# Altium schematic sheet 02_Input.SchDoc
size A
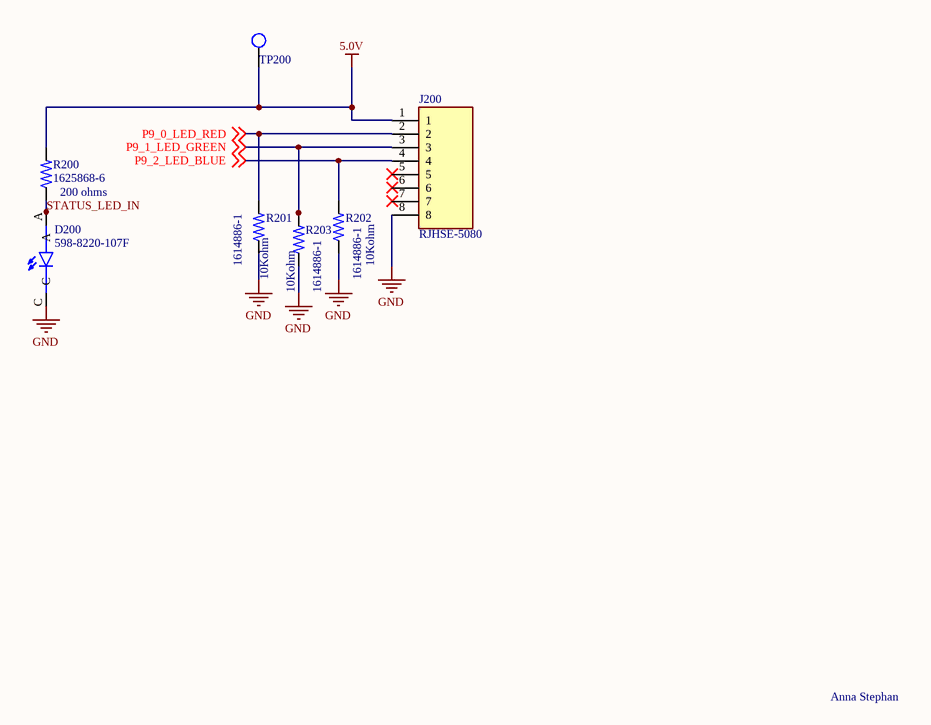
[diagram p0: 02_Input.SchDoc]

## Parts
D200  598-8220-107F  [LEDSC160X320X90-2N]
J200  RJHSE-5080  [CONN_RJSBE5080_16P13X12P57_AMP]
R200  1625868-6  [RESC2012X65N]
R201  1614886-1  [RESC2012X65N]
R202  1614886-1  [RESC2012X65N]
R203  1614886-1  [RESC2012X65N]
TP200  TP_1206  [TP-SMC-1206]  (value not drawn)

## Nets
5.0V: R200.2 TP200.1
GND: D200.C J200.8 R201.1 R202.1 R203.1
P9_0_LED_RED: J200.2 R201.2 ; off-sheet P9_0_LED_RED
P9_1_LED_GREEN: J200.3 R203.2 ; off-sheet P9_1_LED_GREEN
P9_2_LED_BLUE: J200.4 R202.2 ; off-sheet P9_2_LED_BLUE
STATUS_LED_IN: D200.A R200.1

Not connected (* = marked no-connect by the designer): J200 1 5 6 7

## Notes on the sheet
- (near R200) 200 ohms
- (near R201) 10Kohm
- 10Kohm
- (near R203) 10Kohm
- Anna Stephan

## Library data of the parts
D200 = 598-8220-107F: Red 625nm LED Indication - Discrete 2V 1206 _3216 Metric_; MF: Dialight; Value: *; MP: 598-8220-107F; Package: 1206 Dialight; SnapEDA_Link: https://www.snapeda.com/parts/598-8220-107F/Dialight/view-part/454138/?ref=snap
J200 = RJHSE-5080: Jack Modular Connector 8p8c (RJ45, Ethernet) 90Â° Angle (Right) Unshielded; Manufacturer: Amphenol CS (Commercial Products); MF: Amphenol Commercial Products; MP: RJHSE-5080; SnapEDA_Link: https://www.snapeda.com/parts/RJHSE-5080/Amphenol/view-part/4796273/?ref=snap; Package: None; Value: *; Digi-Key_Part_Number: RJHSE-5080-ND; Manufacturer Part No.: RJHSE-5080; Digikey Part No.: RJHSE-5080-ND
R200 = 1625868-6: Resistor 0805 200R 0.1% 25ppm (reel); Package: None; Price: None; Value: *; MP: 1625868-6; Availability: Unavailable
R201-R203 = 1614886-1: CPF0805 10K 0.1% 25PPM 5K RL; Power_Rating: .1 W; Tolerance: .1%; Voltage_Rating: 100 V; MF: TE Connectivity; Availability: Warning; Price: None; Package: 0805; MP: 1614886-1; Value: *; EU_RoHS_Compliance: Compliant; SnapEDA_Link: https://www.snapeda.com/parts/1614886-1/TE%20Connectivity/view-part/2202344/?ref=snap; Resistance: 10K; Check_prices: https://www.snapeda.com/parts/1614886-1/TE%20Connectivity/view-part/2202344/?ref=eda
TP200 = TP_1206: Test Point SMD 1206; Manufacturer: TE Connectivity (Tyco Electronics); Manufacturer Part Number: 1625854-1; Resistance Value: 0 Ohm; Temperature Coefficient: N/R; Supplier: Digi-Key; Stock 1: 31937; Pricing 1: 1=0.28, 10=0.261, 25=0.224, 50=0.1902, 100=0.1828, 250=0.1641, 500=0.1567, 1000=0.1306 (USD); Case Size: 1206; Dimension: 3.2 x 1.6 x 1.25mm; Family: RC; Mounting: Surface Mount; Operating Temperature: -55 to 125 C; Part No: 1625854-1; RoHS: Yes; Packaging: Tape and Reel; Termination Style: N/R; Terminal Pitch: N/R; Power Rating: N/R; Tolerance: N/R; ComponentLink1URL: https://datasheet.ciiva.com/6439/eng-ds-1773266-a-6439169.pdf; ComponentLink1Description: https://datasheet.ciiva.com/6439/eng-ds-1773266-a-6439169.pdf; ComponentLink2URL: https://datasheet.ciiva.com/30136/1773266-a-30136341.pdf; ComponentLink2Description: https://datasheet.ciiva.com/30136/1773266-a-30136341.pdf; ComponentLink3URL: https://datasheet.ciiva.com/6439/eng-ds-1773266-a-6439080.pdf; ComponentLink3Description: https://datasheet.ciiva.com/6439/eng-ds-1773266-a-6439080.pdf; ComponentLink4URL: https://datasheet.ciiva.com/6439/eng-ds-1773266-a-6439081.pdf; ComponentLink4Description: https://datasheet.ciiva.com/6439/eng-ds-1773266-a-6439081.pdf; ComponentLink5URL: https://datasheet.ciiva.com/6439/eng-ds-1773266-a-6439083.pdf; ComponentLink5Description: https://datasheet.ciiva.com/6439/eng-ds-1773266-a-6439083.pdf; Supplier Part Number: A106143CT-ND